# EAGLE design sound-op-switch (EAGLE 6.6.0)
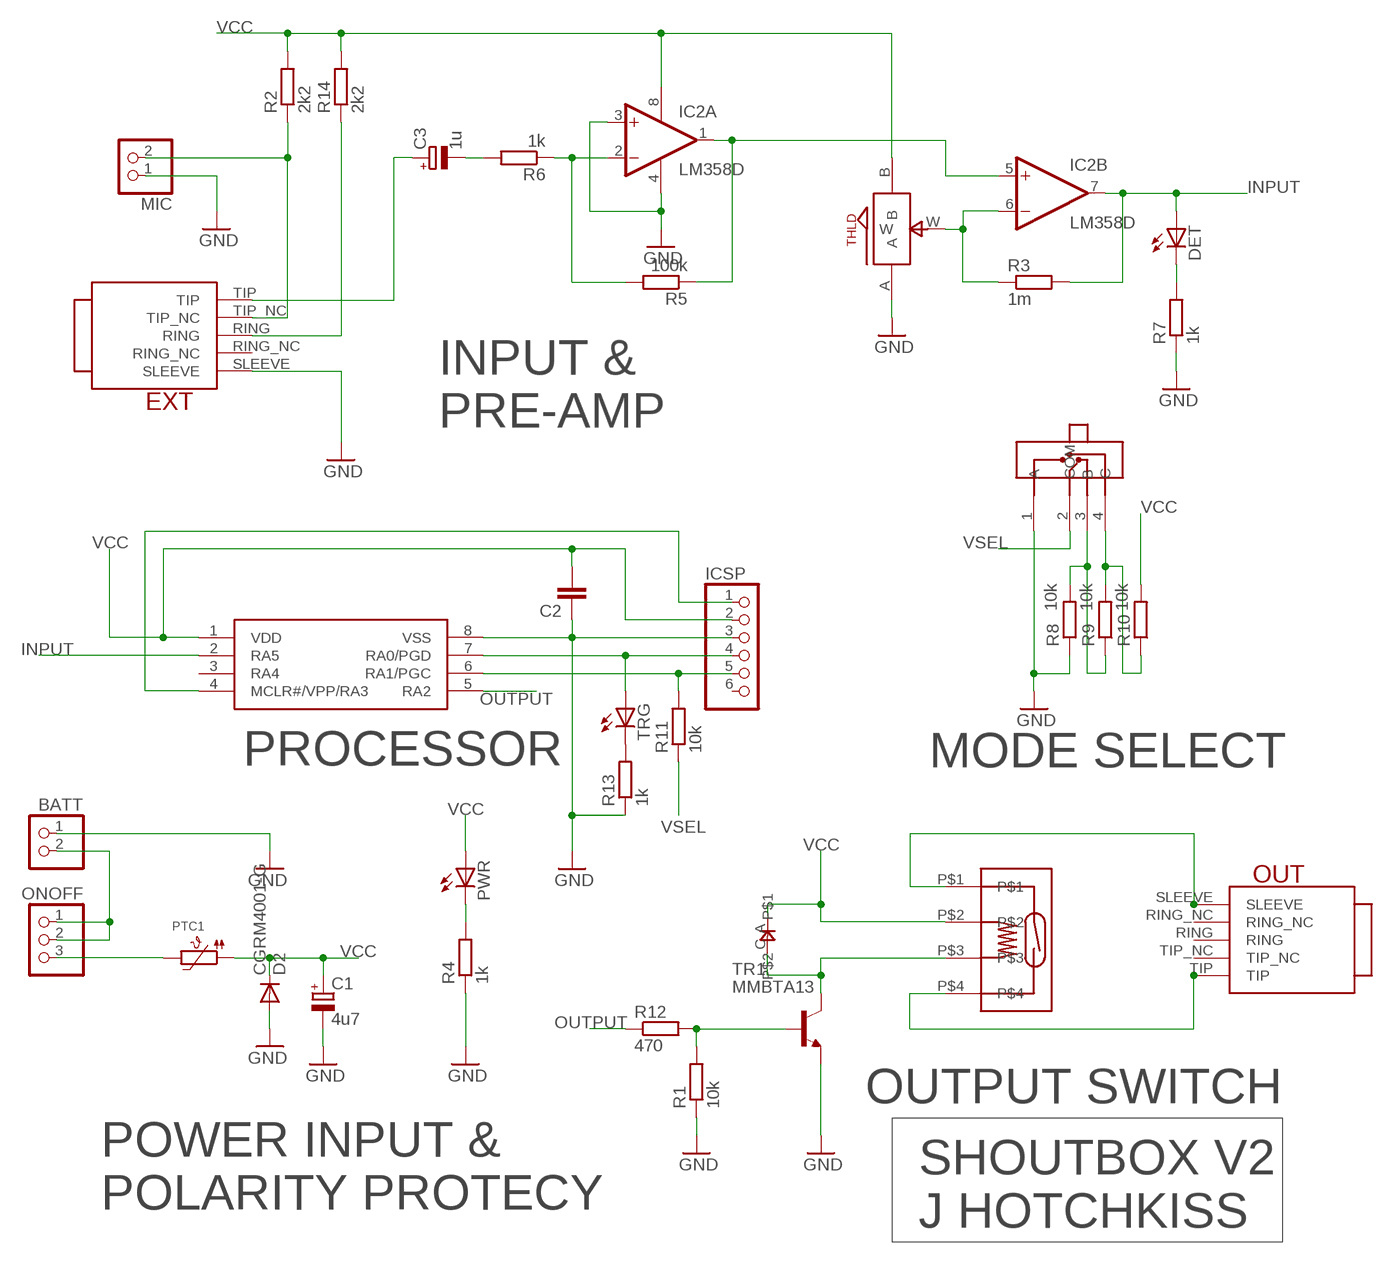
[diagram p0: schematic, sheet 1]

## Parts
BATT  PINHD-1X2  [1X02]
C1  4u7  CPOL-EUE2,5-6E  [E2,5-6E]
C2  C-EUC0805  [C0805]
C3  1u  CPOL-EUE2,5-6E  [E2,5-6E]
D1  0805DIODE  [0805DIODE]
D2  CGRM4001-G  [SOD-123_MINI-SMA]
DET  LED3MM  [LED3MM]
EXT  TRUCONNECTJACK  [TRUCONNECTJACK]
IC1  PIC12F1822  [DIL08]
IC2  LM358D  [SO08]
ICSP  PINHD-1X6  [1X06]
MIC  PINHD-1X2  [1X02]
ONOFF  PINHD-1X3  [1X03]
OUT  TRUCONNECTJACK  [TRUCONNECTJACK]
PTC1  PTC1206  [1206]
PWR  LED3MM  [LED3MM]
R1  10k  R-EU_R0805  [R0805]
R2  2k2  R-EU_R0805  [R0805]
R3  1m  R-EU_R0805  [R0805]
R4  1k  R-EU_R0805  [R0805]
R5  100k  R-EU_R0805  [R0805]
R6  1k  R-EU_R0805  [R0805]
R7  1k  R-EU_R0805  [R0805]
R8  10k  R-EU_R0805  [R0805]
R9  10k  R-EU_R0805  [R0805]
R10  10k  R-EU_R0805  [R0805]
R11  10k  R-EU_R0805  [R0805]
R12  470  R-EU_R0805  [R0805]
R13  1k  R-EU_R0805  [R0805]
R14  2k2  R-EU_R0805  [R0805]
RLY1  9007-REED-RELAY  [9007-REED-RELAY]
SEL  SP4T-SLIDE  [SP3T-SLIDE]
THLD  ALPS_POT_SMALL  [SMALL_ALPS_POT]
TR1  MMBTA13  MMBT3904LT1-NPN-SOT23-BEC  [SOT23-BEC]
TRG  LED3MM  [LED3MM]

## Nets
GND: BATT.1 C1.- C2.1 D2.A EXT.SLEEVE IC1.8(VSS) IC2.3(A:+IN) IC2.4(P:V-) ICSP.3 MIC.1 R1.1 R4.1 R7.1 R8.1 R13.1 SEL.1(A) THLD.A TR1.E
INPUT: DET.A IC1.2(RA5) IC2.7(B:OUT) R3.2
N$1: EXT.TIP_NC MIC.2 R2.1
N$2: C3.- R6.2
N$3: IC2.2(A:-IN) R5.2 R6.1
N$4: DET.K(C) R7.2
N$5: EXT.RING R14.1
N$6: IC1.7(RA0/PGD) ICSP.4 TRG.A
N$7: IC2.1(A:OUT) IC2.5(B:+IN) R5.1
N$8: R9.2 R10.1 SEL.4(C)
N$9: IC1.6(RA1/PGC) ICSP.5 R11.2
N$10: R1.2 R12.2 TR1.B
N$11: IC1.4(MCLR#/VPP/RA3) ICSP.1
N$12: C3.+ EXT.TIP
N$13: IC2.6(B:-IN) R3.1 THLD.W
N$14: R8.2 R9.1 SEL.3(B)
N$15: D1.C RLY1.P$3 TR1.C
N$16: PWR.K(C) R4.2
N$17: R13.2 TRG.K(C)
N$18: BATT.2 ONOFF.1 ONOFF.2
N$19: ONOFF.3 PTC1.2
N$27: OUT.SLEEVE RLY1.P$1
N$28: OUT.TIP RLY1.P$4
OUTPUT: IC1.5(RA2) R12.1
VCC: C1.+ C2.2 D1.A D2.C IC1.1(VDD) IC2.8(P:V+) ICSP.2 PTC1.1 PWR.A R2.2 R10.2 R14.2 RLY1.P$2 THLD.B
VSEL: R11.1 SEL.2(COM)
Unconnected: EXT.RING_NC IC1.3(RA4) ICSP.6 OUT.RING OUT.RING_NC OUT.TIP_NC

## Notes on the sheet
- INPUT &
  PRE-AMP
- PROCESSOR | MODE SELECT
- OUTPUT SWITCH
- SHOUTBOX V2
- POWER INPUT & 
  POLARITY PROTECY
- J HOTCHKISS

## Library data of the parts
BATT MIC = pinhead:PINHD-1X2: PIN HEADER
C1 C3 = rcl:CPOL-EU: POLARIZED CAPACITOR, European symbol
C2 = resistor:C-EU: CAPACITOR, European symbol
D1 = jasons_stuff:0805DIODE
D2 = diode:CGRM400*-G: Molded plasitc,JEDEC SOD-123/Mini SMA Source: Comchip CGRM4001-G.pdf
DET PWR TRG = led:LED: LED OSRAM: - CHIPLED LG R971, LG N971, LY N971, LG Q971, LY Q971, LO R971, LY R971 LH N974, LH R974 LS Q976, LO Q976, LY Q976 LO Q996 - Hyper CHIPLED LW Q18S LB Q993, LB Q99A, LB R99A - SideLED LS A670, LO A670, LY A670, LG A670, LP A670 LB A673, LV A673, LT A673, LW A673 LH A674 LY A675 LS A676, LA A676, LO A676, LY A676, LW A676 LS A679, LY A679, LG A679 - Hyper Micro SIDELED® LS Y876, LA Y876, LO Y876, LY Y876 LT Y87S - SmartLED LW L88C, LW L88S LB L89C, LB L89S, LG L890 LS L89K, LO L89K, LY L89K LS L896, LA L896, LO L896, LY L896 - TOPLED LS T670, LO T670, LY T670, LG T670, LP T670 LSG T670, LSP T670, LSY T670, LOP T670, LYG T670 LG T671, LOG T671, LSG T671 LB T673, LV T673, LT T673, LW T673 LH T674 LS T676, LA T676, LO T676, LY T676, LB T676, LH T676, LSB T676, LW T676 LB T67C, LV T67C, LT T67C, LS T67K, LO T67K, LY T67K, LW E67C LS E67B, LA E67B, LO E67B, LY E67B, LB E67C, LV E67C, LT E67C LW T67C LS T679, LY T679, LG T679 LS T770, LO T770, LY T770, LG T770, LP T770 LB T773, LV T773, LT T773, LW T773 LH T774 LS E675, LA E675, LY E675, LS T675 LS T776, LA T776, LO T776, LY T776, LB T776 LHGB T686 LT T68C, LB T68C - Hyper Mini TOPLED® LB M676 - Mini TOPLED Santana® LG M470 LS M47K, LO M47K, LY M47K Source: http://www.osram.convergy.de LUXEON: - LUMILED® LXK2-PW12-R00, LXK2-PW12-S00, LXK2-PW14-U00, LXK2-PW14-V00 LXK2-PM12-R00, LXK2-PM12-S00, LXK2-PM14-U00 LXK2-PE12-Q00, LXK2-PE12-R00, LXK2-PE12-S00, LXK2-PE14-T00, LXK2-PE14-U00 LXK2-PB12-K00, LXK2-PB12-L00, LXK2-PB12-M00, LXK2-PB14-N00, LXK2-PB14-P00, LXK2-PB14-Q00 LXK2-PR12-L00, LXK2-PR12-M00, LXK2-PR14-Q00, LXK2-PR14-R00 LXK2-PD12-Q00, LXK2-PD12-R00, LXK2-PD12-S00 LXK2-PH12-R00, LXK2-PH12-S00 LXK2-PL12-P00, LXK2-PL12-Q00, LXK2-PL12-R00 Source: www.luxeon.com KINGBRIGHT: KA-3528ASYC Source: www.kingbright.com
EXT OUT = jason_eagle6:TRUCONNECTJACK
IC1 = jasons_stuff:PIC12F1822
IC2 = linear:LM358: OP AMP also LM158; LM258; LM2904 Source: http://cache.national.com/ds/LM/LM158.pdf
ICSP = pinhead:PINHD-1X6: PIN HEADER
ONOFF = pinhead:PINHD-1X3: PIN HEADER
PTC1 = microbuilder:PTC: PTC (Resettable Fuse) 1206 Package 250mA PTC (16V Max, Time-to-Trip: 0.08s) - Digikey: F2110CT-ND 1210 Package 100mA PTC (30V Max, Time-to-Trip: 0.6s) - Digikey: MF-USMF010-2CT-ND 1812 Package 750mA PTC (24V Max, Time-to-Trip: 0.2s) - Digikey: MF-MSMF075/24-2CT-ND
R1-R4 R7-R14 = resistor:R-EU_: RESISTOR, European symbol
R5 R6 = rcl:R-EU_: RESISTOR, European symbol
RLY1 = jason_eagle6:9007-REED-RELAY
SEL = jason_eagle6:SP4T-SLIDE
THLD = jasons_stuff:ALPS_POT_SMALL
TR1 = transistor-neu-to92:*-NPN-: NPN Transistror

## Board
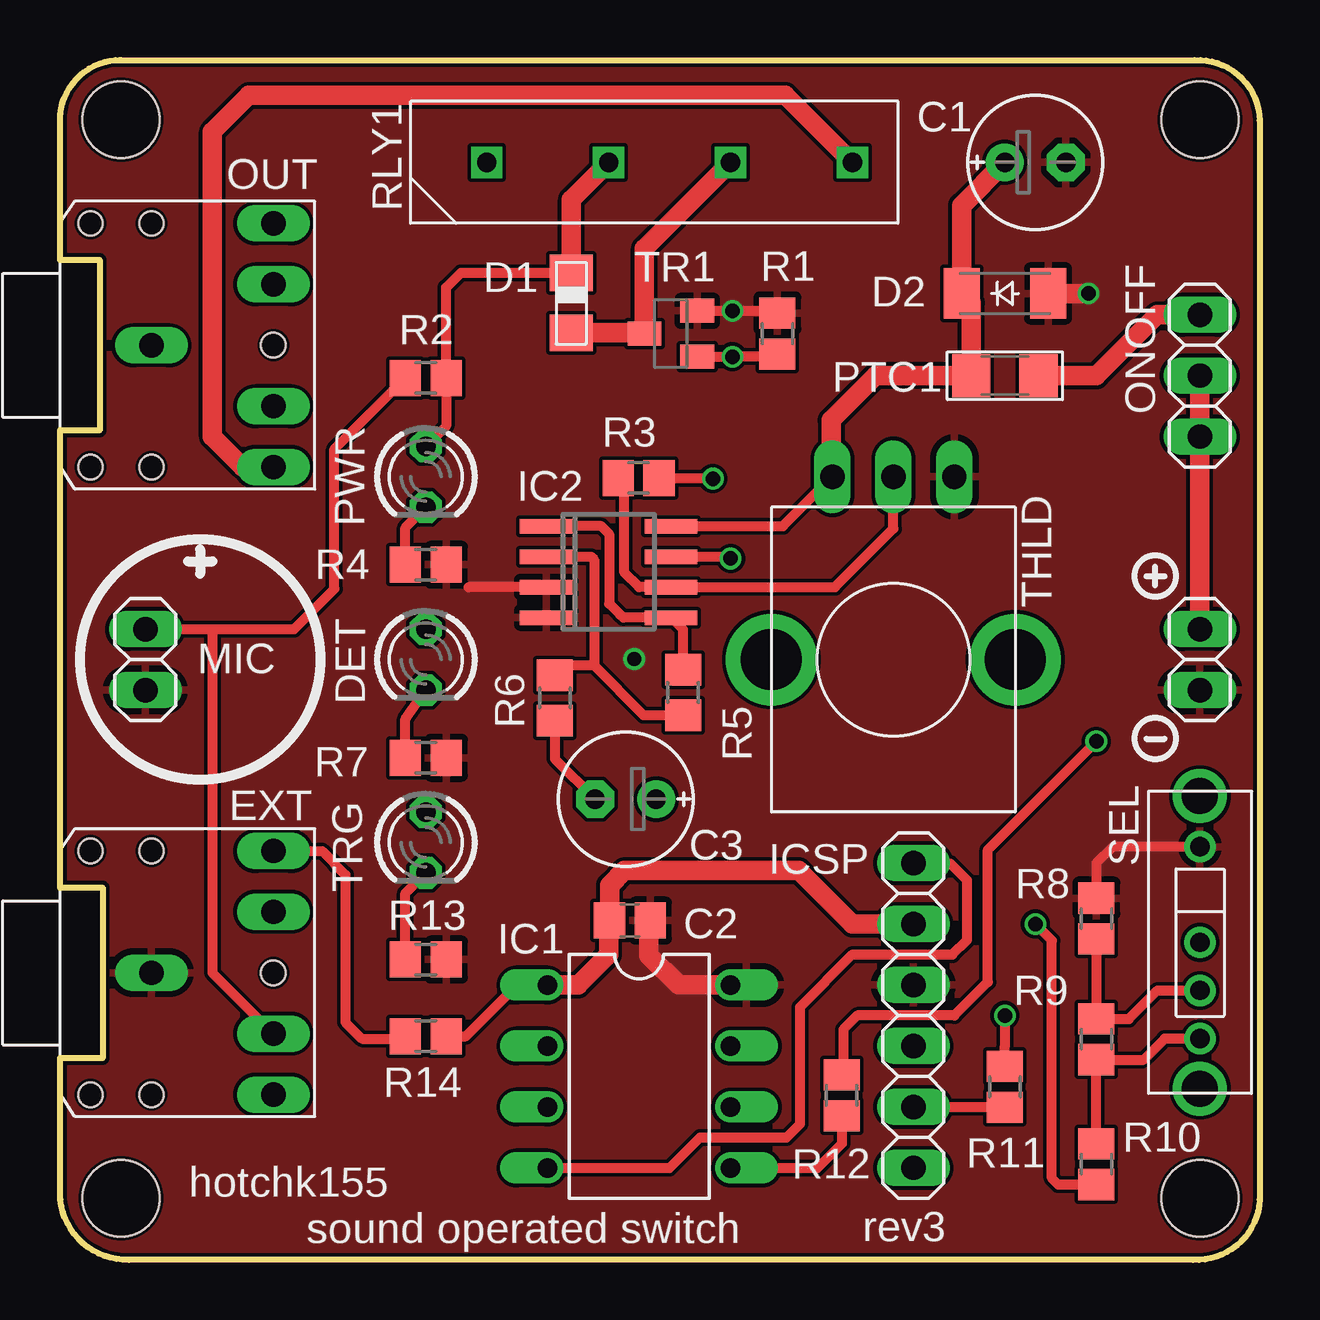
[diagram p1: board, top side]
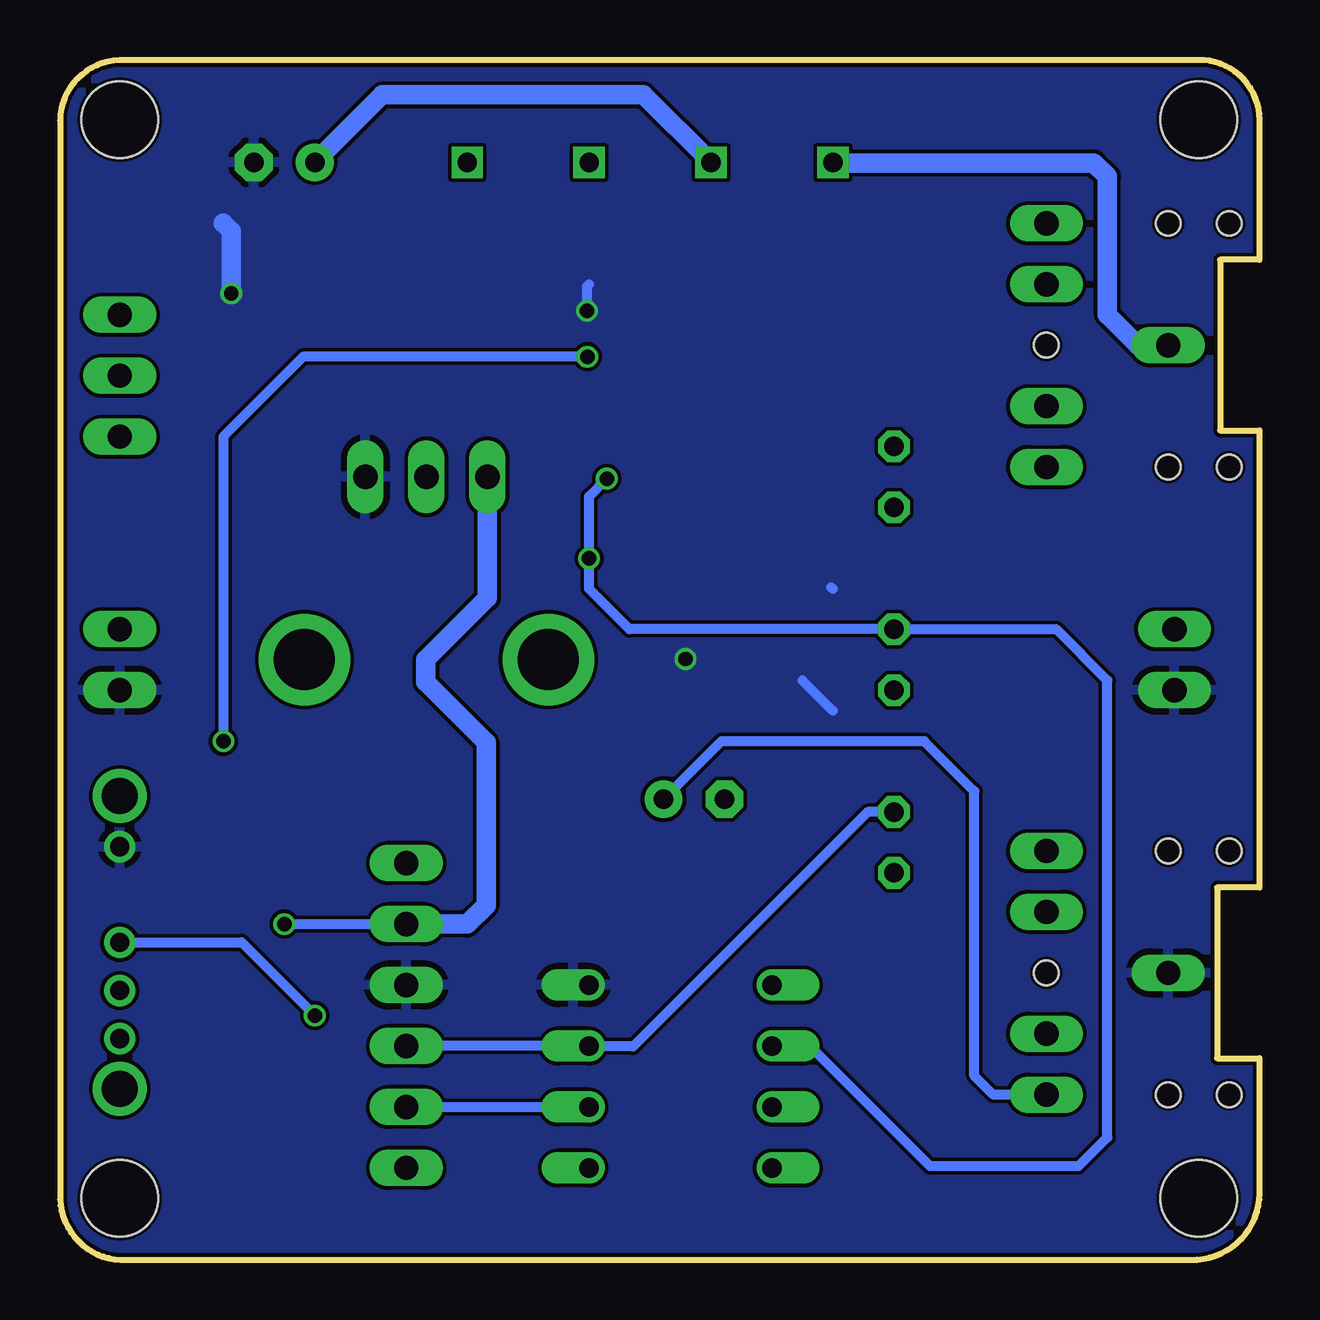
[diagram p2: board, bottom side, seen from below]

Size 49.99 x 50.01 mm. Coordinates in mm from the lower left corner, seen from the top.
Outline: 2.49,50.01 2.54,50.01
Outline: 2.54,50.01 47.27,50.01 arc-91 49.99,47.5 49.99,2.51 arc-90 47.22,0 2.87,0 arc-91 0,2.77 0,8.41 1.78,8.41 1.78,15.52 0,15.52 0,34.57 1.65,34.57 1.65,41.68 0,41.68 0,47.37 0,47.4 0,47.52 arc-90 2.54,50.01
Copper layers (1*16): Top 0.035mm / dielectric 1.5mm / Bottom 0.035mm
Design rules "hackvana": minimum track width 6mil, minimum drill 0.3mm, track to track 6mil, track to pad 6mil, pad to pad 6mil, via to via 6mil, smd to smd 0mil, copper to edge 6mil, drill to drill 6mil, minimum pad ring 10mil, minimum via ring 6mil, stop-mask expansion 2mil, vias tented up to drill 100mil, thermal gap 10mil
Holes 3.2 mm at 47.5,2.57 2.54,47.52 47.5,47.52 2.54,2.57

### Footprints (pad centres in the part's own frame; a part is rotated, then mirrored left to right if it is on the bottom)
1X02 = drill 1.016 long: 1 -1.27,0; 2 1.27,0
E2,5-6E = drill 0.813 pad 1.575: + -1.27,0 | drill 0.813 pad 1.575 octagon: - 1.27,0
C0805 = smd 1.3 x 1.5: 1 -0.85,0; 2 0.85,0
0805DIODE = smd 1.524 x 1.778: A -1.262,-0.005; C 1.238,-0.005
SOD-123_MINI-SMA = smd 1.5 x 2.1: A 1.8,0; C -1.8,0
LED3MM = drill 0.813 octagon: A -1.27,0; K 1.27,0
TRUCONNECTJACK = drill 1.016 long: RING -1.27,-5.08; RING_NC -1.27,-2.54; SLEEVE 3.81,0; TIP -1.27,5.08; TIP_NC -1.27,2.54 | hole 1.016: 3.81,5.08; 6.35,5.08; 3.81,-5.08; 6.35,-5.08; -1.27,0
DIL08 = drill 0.813 offset: 1 -3.81,-3.81; 2 -1.27,-3.81; 3 1.27,-3.81; 4 3.81,-3.81; 5 3.81,3.81; 6 1.27,3.81; 7 -1.27,3.81; 8 -3.81,3.81
SO08 = smd 0.6 x 2.2: 1 -1.905,-2.6; 2 -0.635,-2.6; 3 0.635,-2.6; 4 1.905,-2.6; 5 1.905,2.6; 6 0.635,2.6; 7 -0.635,2.6; 8 -1.905,2.6
1X06 = drill 1.016 long: 1 -6.35,0; 2 -3.81,0; 3 -1.27,0; 4 1.27,0; 5 3.81,0; 6 6.35,0
1X03 = drill 1.016 long: 1 -2.54,0; 2 0,0; 3 2.54,0
1206 = smd 1.6 x 1.8: 1 -1.4,0; 2 1.4,0
R0805 = smd 1.3 x 1.5: 1 -0.85,0; 2 0.85,0
R0805' = smd 1.3 x 1.5: 1 -0.95,0; 2 0.95,0
9007-REED-RELAY = drill 0.8 square: P$1 0,7.62; P$2 0,2.54; P$3 0,-2.54; P$4 0,-7.62
SP3T-SLIDE = drill 0.8: 1 -3.988,0; 2 0,0; 3 2.007,0; 4 4.013,0 | drill 1.499: X -6.096,0; Y 6.096,0
SMALL_ALPS_POT = drill 1.016 long: A -2.54,-7.62; B 2.54,-7.62; W 0,-7.62 | drill 2.54 pad 3.81: GND@1 -5.08,0; GND@2 5.08,0
SOT23-BEC = smd 1 x 1.4: B -0.95,-1.1; C 0,1.1; E 0.95,-1.1

### Placement (x,y rotation side)
BATT  47.5,25.02 90 top
C1  40.64,45.75 0 top
C2  23.75,14.15 180 top
C3  23.57,19.2 180 top
D1  21.31,39.88 270 top
D2  39.37,40.28 0 top
DET  15.24,25.02 270 top
EXT  7.62,11.96 180 top
IC1  24.13,7.65 270 top
IC2  22.86,28.68 270 top
ICSP  35.56,10.19 270 top
MIC  3.56,25.02 90 top
ONOFF  47.5,36.86 90 top
OUT  7.62,38.13 180 top
PTC1  39.37,36.86 0 top
PWR  15.24,32.64 270 top
R1  29.9,38.61 270 top
R2  15.24,36.75 0 top
R3  24.1,32.59 0 top
R4  15.24,28.98 180 top
R5  100k  [R0805']  25.96,23.65 270 top
R6  1k  [R0805']  20.62,23.42 270 top
R7  15.24,20.93 180 top
R8  43.18,14.22 270 top
R9  43.18,9.2 270 top
R10  43.18,3.99 270 top
R11  39.37,7.21 270 top
R12  32.56,6.86 90 top
R13  15.24,12.52 180 top
R14  15.24,9.32 0 top
RLY1  25.4,45.75 90 top
SEL  47.5,13.23 270 top
THLD  34.72,25.02 180 top
TR1  25.45,38.61 90 top
TRG  15.24,17.4 270 top

### Tracks (layer width: path | path; a pad name or v marks a point on that pad's centre or on a via)
GND  (via drill 0.6)
  Top 0.406: SEL.1 43.87,17.22 43.18,16.54 R8.1 | TR1.E v28.03,39.56 29.8,39.56 R1.1 | 24.56,14.11 C2.1 | IC2.3 17.03,28.04 | R7.1 16.09,21.2
  Top 0.813: D2.A v42.85,40.28 | IC1.8 25.78,11.46 24.54,12.7 24.54,14.09 C2.1
  Bottom 0.406: v28.03,39.56 28.03,40.58 27.94,40.67 | 17.86,28.04 17.78,27.97 | 17.78,22.89 19.05,24.16
  Bottom 0.813: v42.85,40.28 42.85,42.88 43.18,43.21
  other vias: 23.93,25.04
  pour Bottom: -7.62,52.1 -7.62,-3.78 53.34,-3.78 53.34,53.37 -7.62,53.37
  pour Top: -7.62,52.1 -7.62,-10.13 58.42,-10.13 58.42,53.37 -7.62,53.37
INPUT  (via drill 0.6)
  Top 0.406: IC2.7 27.86,29.31 v27.94,29.24 | v27.2,32.56 24.98,32.56 R3.2
  Bottom 0.406: v27.2,32.56 27.94,31.83 v27.94,29.24 27.94,27.97 26.26,26.29 DET.A 8.48,26.29 6.35,24.16 6.35,5.11 7.54,3.91 13.74,3.91 18.75,8.92 IC1.2
N$1
  Top 0.406: 6.35,26.29 MIC.2 5.94,26.29 | 6.35,26.29 9.75,26.29 11.43,27.97 11.43,33.79 R2.1 | 6.35,26.29 6.35,11.96 EXT.TIP_NC
N$2
  Top 0.406: R6.2 20.62,20.88 C3.-
N$3
  Top 0.406: R5.2 24.32,22.7 22.25,24.77 | IC2.2 22.12,29.31 22.25,29.18 22.25,24.77 | 22.25,24.77 21.02,24.77 R6.1
N$4
  Top 0.406: R7.2 14.39,22.54 DET.K
N$5
  Top 0.406: EXT.RING 10.92,17.04 11.43,16.54 11.43,16.51 11.89,16.05 11.89,9.91 12.57,9.22 14.29,9.22 R14.1
N$6
  Bottom 0.406: ICSP.4 IC1.7 27.91,8.89 26.11,8.89 16.33,18.67 TRG.A
N$7
  Top 0.406: IC2.1 22.55,30.58 22.89,30.25 22.89,27.36 23.2,27.04 23.34,26.9 23.47,26.77 IC2.5 25.96,26.27 R5.1
N$8
  Top 0.406: R10.1 R9.2 45.15,8.34 46.02,9.22 SEL.4
N$9
  Top 0.406: R11.2 35.57,6.36 ICSP.5
  Bottom 0.406: ICSP.5 IC1.6
N$10  (via drill 0.6)
  Top 0.406: TR1.B 28.03,37.66 | R1.2 29.8,37.66 28.03,37.66 | 28.03,37.66 v28.02,37.64 | R12.2 32.64,7.78 32.64,9.6 33.22,10.19 37.26,10.19 38.66,11.58 38.66,17.09 v43.18,21.62
  Bottom 0.406: v28.02,37.64 39.85,37.64 43.18,34.32 v43.18,21.62
N$11
  Top 0.406: ICSP.1 35.59,16.51 37.11,16.51 37.8,15.82 37.8,13.34 37.19,12.73 33.02,12.73 30.84,10.54 30.84,5.66 30.28,5.11 26.67,5.11 25.4,3.84 IC1.4
N$12
  Bottom 0.406: C3.+ 22.43,21.62 13.97,21.62 11.89,19.53 11.89,7.67 11.1,6.88 EXT.TIP
N$13
  Top 0.406: THLD.W 34.72,30.48 32.28,28.04 IC2.6 24.13,28.04 23.52,28.65 23.52,32.32 R3.1
N$14
  Top 0.406: SEL.3 45.72,11.23 44.54,10.04 R9.1 R8.2
N$15
  Top 0.813: D1.C 24.32,38.64 TR1.C 24.35,42.16 RLY1.P$3
N$16
  Top 0.406: R4.2 14.39,30.52 PWR.K
N$17
  Top 0.406: R13.2 14.39,15.28 TRG.K
N$18
  Top 0.813: BATT.2 ONOFF.1 ONOFF.2
N$19
  Top 0.813: PTC1.2 43.18,36.86 45.72,39.4 ONOFF.3
N$27
  Bottom 0.813: OUT.SLEEVE 5.08,38.13 6.35,39.4 6.35,45.16 6.91,45.72 17.75,45.72 RLY1.P$1
N$28
  Top 0.813: OUT.TIP 7.62,33.05 6.35,34.32 6.35,47.02 7.87,48.54 30.23,48.54 RLY1.P$4
OUTPUT
  Top 0.406: IC1.5 31.57,3.84 32.59,4.85 32.59,5.98 R12.1
VCC  (via drill 0.6)
  Top 0.406: R14.2 16.92,9.32 19.05,11.46 IC1.1 | IC2.8 30.12,30.58 THLD.B | PWR.A 16.09,34.76 R2.2 16.09,40.52 16.71,41.15 21.3,41.15 D1.A | 22.89,14.16 C2.2 | R10.2 41.59,3.14 41.33,3.4 41.33,13.31 v40.64,14
  Top 0.813: C1.+ 37.57,43.95 D2.C 37.97,39.88 PTC1.1 33.98,36.86 32.13,35 32.13,32.69 THLD.B | D1.A 21.31,44.19 RLY1.P$2 | IC1.1 21.59,11.46 22.86,12.73 22.86,14.11 C2.2 22.9,15.61 23.52,16.23 30.79,16.23 33.02,14 ICSP.2
  Bottom 0.406: v40.64,14 ICSP.2
  Bottom 0.813: C1.+ 36.55,48.56 25.68,48.56 RLY1.P$2 | THLD.B 32.18,27.58 34.75,25.02 34.75,24.08 32.23,21.56 32.23,14.78 33.02,14 ICSP.2
VSEL  (via drill 0.6)
  Top 0.406: R11.1 39.37,8.92 v39.37,10.19
  Bottom 0.406: SEL.2 42.42,13.23 v39.37,10.19

### Text on the board
tNames: hotchk155 | sound operated switch | rev3